# EAGLE design SevenSegmentArrays (EAGLE 6.5.0)
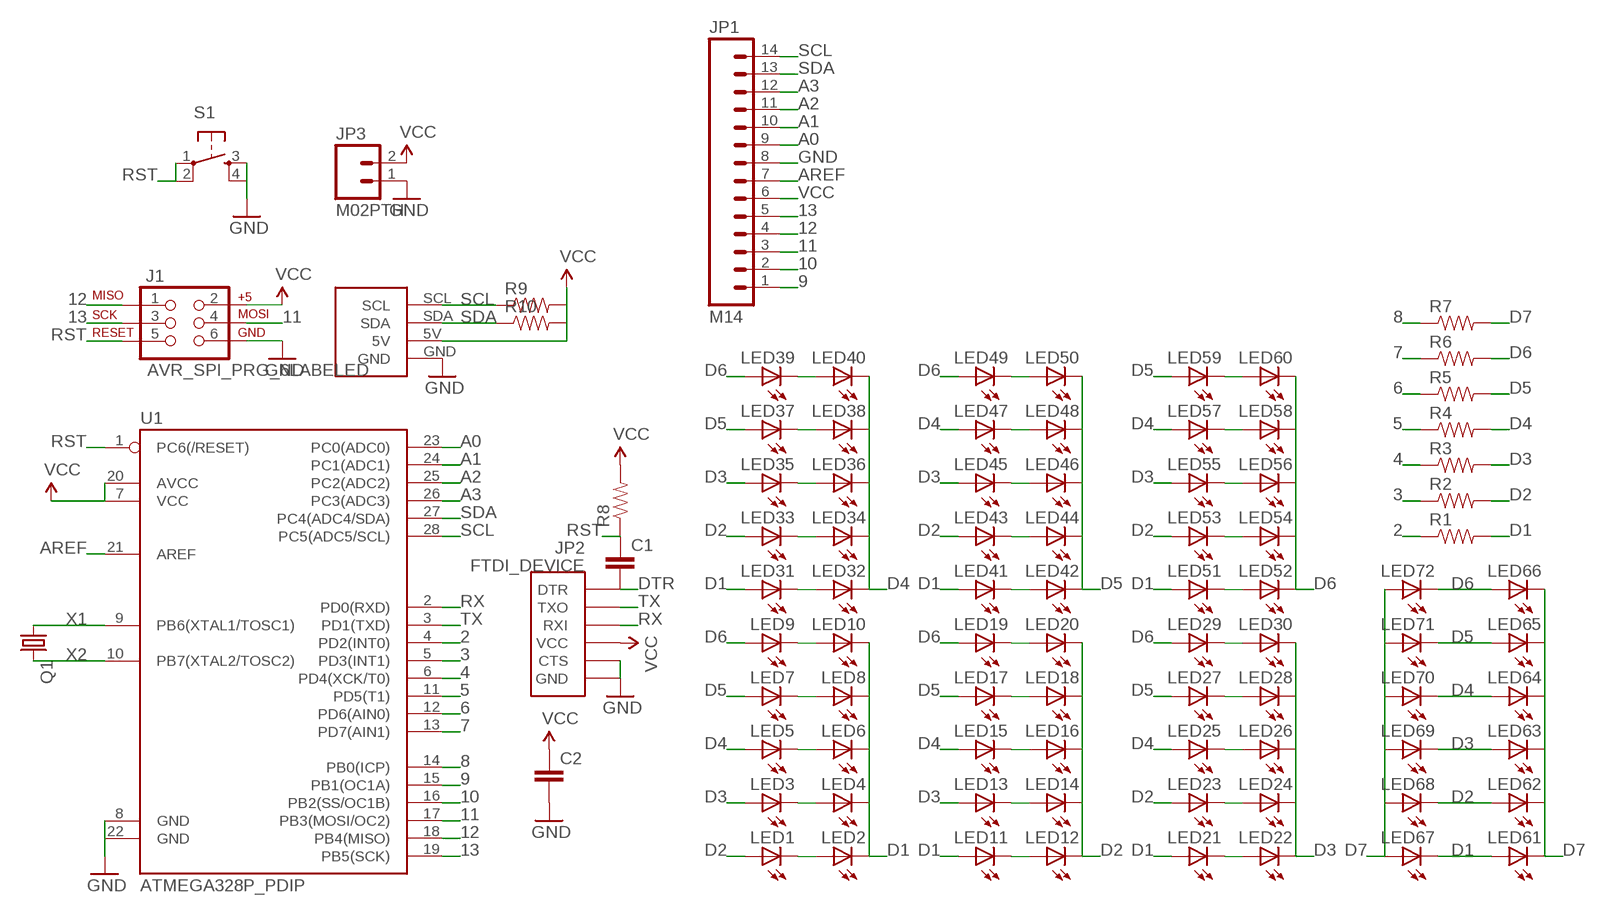
[diagram p0: schematic, sheet 1]

## Parts
C1  CAPPTH  [CAP-PTH-SMALL]
C2  CAPPTH  [CAP-PTH-SMALL]
J1  AVR_SPI_PRG_6LABELED  [2X3-NS]
JP1  M14  [1X14]
JP2  FTDI_DEVICE  [FTDI_DEVICE_SIDE]
JP3  M02PTH  [1X02]
LED1  LEDRECT  [RECTANGLE_LED]
LED2  LEDRECT  [RECTANGLE_LED]
LED3  LEDRECT  [RECTANGLE_LED]
LED4  LEDRECT  [RECTANGLE_LED]
LED5  LEDRECT  [RECTANGLE_LED]
LED6  LEDRECT  [RECTANGLE_LED]
LED7  LEDRECT  [RECTANGLE_LED]
LED8  LEDRECT  [RECTANGLE_LED]
LED9  LEDRECT  [RECTANGLE_LED]
LED10  LEDRECT  [RECTANGLE_LED]
LED11  LEDRECT  [RECTANGLE_LED]
LED12  LEDRECT  [RECTANGLE_LED]
LED13  LEDRECT  [RECTANGLE_LED]
LED14  LEDRECT  [RECTANGLE_LED]
LED15  LEDRECT  [RECTANGLE_LED]
LED16  LEDRECT  [RECTANGLE_LED]
LED17  LEDRECT  [RECTANGLE_LED]
LED18  LEDRECT  [RECTANGLE_LED]
LED19  LEDRECT  [RECTANGLE_LED]
LED20  LEDRECT  [RECTANGLE_LED]
LED21  LEDRECT  [RECTANGLE_LED]
LED22  LEDRECT  [RECTANGLE_LED]
LED23  LEDRECT  [RECTANGLE_LED]
LED24  LEDRECT  [RECTANGLE_LED]
LED25  LEDRECT  [RECTANGLE_LED]
LED26  LEDRECT  [RECTANGLE_LED]
LED27  LEDRECT  [RECTANGLE_LED]
LED28  LEDRECT  [RECTANGLE_LED]
LED29  LEDRECT  [RECTANGLE_LED]
LED30  LEDRECT  [RECTANGLE_LED]
LED31  LEDRECT  [RECTANGLE_LED]
LED32  LEDRECT  [RECTANGLE_LED]
LED33  LEDRECT  [RECTANGLE_LED]
LED34  LEDRECT  [RECTANGLE_LED]
LED35  LEDRECT  [RECTANGLE_LED]
LED36  LEDRECT  [RECTANGLE_LED]
LED37  LEDRECT  [RECTANGLE_LED]
LED38  LEDRECT  [RECTANGLE_LED]
LED39  LEDRECT  [RECTANGLE_LED]
LED40  LEDRECT  [RECTANGLE_LED]
LED41  LEDRECT  [RECTANGLE_LED]
LED42  LEDRECT  [RECTANGLE_LED]
LED43  LEDRECT  [RECTANGLE_LED]
LED44  LEDRECT  [RECTANGLE_LED]
LED45  LEDRECT  [RECTANGLE_LED]
LED46  LEDRECT  [RECTANGLE_LED]
LED47  LEDRECT  [RECTANGLE_LED]
LED48  LEDRECT  [RECTANGLE_LED]
LED49  LEDRECT  [RECTANGLE_LED]
LED50  LEDRECT  [RECTANGLE_LED]
LED51  LEDRECT  [RECTANGLE_LED]
LED52  LEDRECT  [RECTANGLE_LED]
LED53  LEDRECT  [RECTANGLE_LED]
LED54  LEDRECT  [RECTANGLE_LED]
LED55  LEDRECT  [RECTANGLE_LED]
LED56  LEDRECT  [RECTANGLE_LED]
LED57  LED3MM  [LED3MM]
LED58  LED3MM  [LED3MM]
LED59  LED3MM  [LED3MM]
LED60  LED3MM  [LED3MM]
LED61  LED3MM  [LED3MM]
LED62  LED3MM  [LED3MM]
LED63  LED3MM  [LED3MM]
LED64  LED3MM  [LED3MM]
LED65  LED3MM  [LED3MM]
LED66  LED3MM  [LED3MM]
LED67  LED3MM  [LED3MM]
LED68  LED3MM  [LED3MM]
LED69  LED3MM  [LED3MM]
LED70  LED3MM  [LED3MM]
LED71  LED3MM  [LED3MM]
LED72  LED3MM  [LED3MM]
Q1  CRYSTALTC38H  [TC38H]
R1  RESISTORAXIAL-0.3  [AXIAL-0.3]
R2  RESISTORAXIAL-0.3  [AXIAL-0.3]
R3  RESISTORAXIAL-0.3  [AXIAL-0.3]
R4  RESISTORAXIAL-0.3  [AXIAL-0.3]
R5  RESISTORAXIAL-0.3  [AXIAL-0.3]
R6  RESISTORAXIAL-0.3  [AXIAL-0.3]
R7  RESISTORAXIAL-0.3  [AXIAL-0.3]
R8  RESISTORAXIAL-0.3  [AXIAL-0.3]
R9  RESISTORAXIAL-0.3  [AXIAL-0.3]
R10  RESISTORAXIAL-0.3  [AXIAL-0.3]
S1  TAC_SWITCHPTH  [TACTILE-PTH]
U1  ATMEGA328P_PDIP  [DIL28-3]
U$1  I2C  [I2C]

## Nets
2: R1.P$1 U1.4(PD2(INT0))
3: R2.P$1 U1.5(PD3(INT1))
4: R3.P$1 U1.6(PD4(XCK/T0))
5: R4.P$1 U1.11(PD5(T1))
6: R5.P$1 U1.12(PD6(AIN0))
7: R6.P$1 U1.13(PD7(AIN1))
8: R7.P$1 U1.14(PB0(ICP))
9: JP1.1 U1.15(PB1(OC1A))
10: JP1.2 U1.16(PB2(SS/OC1B))
11: J1.4 JP1.3 U1.17(PB3(MOSI/OC2))
12: J1.1 JP1.4 U1.18(PB4(MISO))
13: J1.3 JP1.5 U1.19(PB5(SCK))
A0: JP1.9 U1.23(PC0(ADC0))
A1: JP1.10 U1.24(PC1(ADC1))
A2: JP1.11 U1.25(PC2(ADC2))
A3: JP1.12 U1.26(PC3(ADC3))
AREF: JP1.7 U1.21(AREF)
D1: LED2.C LED4.C LED6.C LED8.C LED10.C LED11.A LED21.A LED31.A LED41.A LED51.A LED61.A LED67.K(C) R1.P$2
D2: LED1.A LED12.C LED14.C LED16.C LED18.C LED20.C LED23.A LED33.A LED43.A LED53.A LED62.A LED68.K(C) R2.P$2
D3: LED3.A LED13.A LED22.C LED24.C LED26.C LED28.C LED30.C LED35.A LED45.A LED55.A LED63.A LED69.K(C) R3.P$2
D4: LED5.A LED15.A LED25.A LED32.C LED34.C LED36.C LED38.C LED40.C LED47.A LED57.A LED64.A LED70.K(C) R4.P$2
D5: LED7.A LED17.A LED27.A LED37.A LED42.C LED44.C LED46.C LED48.C LED50.C LED59.A LED65.A LED71.K(C) R5.P$2
D6: LED9.A LED19.A LED29.A LED39.A LED49.A LED52.C LED54.C LED56.C LED58.K(C) LED60.K(C) LED66.A LED72.K(C) R6.P$2
D7: LED61.K(C) LED62.K(C) LED63.K(C) LED64.K(C) LED65.K(C) LED66.K(C) LED67.A LED68.A LED69.A LED70.A LED71.A LED72.A R7.P$2
DTR: C1.2 JP2.P$1(DTR)
GND: C2.2 J1.6 JP1.8 JP2.P$5(CTS) JP2.P$6(GND) JP3.1 S1.3 S1.4 U1.8(GND) U1.22(GND) U$1.GND
N$1: LED1.C LED2.A
N$2: LED3.C LED4.A
N$3: LED5.C LED6.A
N$4: LED7.C LED8.A
N$5: LED9.C LED10.A
N$6: LED11.C LED12.A
N$7: LED13.C LED14.A
N$8: LED15.C LED16.A
N$9: LED17.C LED18.A
N$10: LED19.C LED20.A
N$11: LED21.C LED22.A
N$12: LED23.C LED24.A
N$13: LED25.C LED26.A
N$14: LED27.C LED28.A
N$15: LED29.C LED30.A
N$16: LED31.C LED32.A
N$17: LED33.C LED34.A
N$18: LED35.C LED36.A
N$19: LED37.C LED38.A
N$20: LED39.C LED40.A
N$21: LED41.C LED42.A
N$22: LED43.C LED44.A
N$23: LED45.C LED46.A
N$24: LED47.C LED48.A
N$25: LED49.C LED50.A
N$26: LED51.C LED52.A
N$27: LED53.C LED54.A
N$28: LED55.C LED56.A
N$29: LED57.K(C) LED58.A
N$30: LED59.K(C) LED60.A
RST: C1.1 J1.5 R8.P$1 S1.1 S1.2 U1.1(PC6(/RESET))
RX: JP2.P$3(RXI) U1.2(PD0(RXD))
SCL: JP1.14 R9.P$1 U1.28(PC5(ADC5/SCL)) U$1.SCL
SDA: JP1.13 R10.P$1 U1.27(PC4(ADC4/SDA)) U$1.SDA
TX: JP2.P$2(TXO) U1.3(PD1(TXD))
VCC: C2.1 J1.2 JP1.6 JP2.P$4(VCC) JP3.2 R8.P$2 R9.P$2 R10.P$2 U1.7(VCC) U1.20(AVCC) U$1.5V
X1: Q1.1 U1.9(PB6(XTAL1/TOSC1))
X2: Q1.2 U1.10(PB7(XTAL2/TOSC2))

## Library data of the parts
C1 C2 = SparkFun-Capacitors:CAP: Capacitor Standard 0603 ceramic capacitor, and 0.1" leaded capacitor.
J1 = barbary_enterprises:AVR_SPI_PRG_6: AVR ISP 6 Pin This is the reduced ISP connector for AVR programming. Common on Arduino. This footprint will take up less PCB space and can be used with a 10-pin to 6-pin adapter such as SKU: BOB-08508
JP1 = SparkFun-Connectors:M14: Header 14 Standard 14-pin 0.1" header. Use with straight break away headers (SKU : PRT-00116), right angle break away headers (PRT-00553), swiss pins (PRT-00743), machine pins (PRT-00117), and female headers (PRT-00115).
JP2 = SparkFun-Connectors:FTDI_DEVICE: Connector which mates to FTDI basic or FTDI cable.
JP3 = SparkFun-Connectors:M02: Standard 2-pin 0.1" header. Use with - straight break away headers ( PRT-00116) - right angle break away headers (PRT-00553) - swiss pins (PRT-00743) - machine pins (PRT-00117) - female headers (PRT-00115) Molex polarized connector foot print use with: PRT-08233 with associated crimp pins and housings. 2.54_SCREWTERM for use with PRT-10571. 3.5mm Screw Terminal footprints for PRT-08084 5mm Screw Terminal footprints for use with PRT-08433
LED1-LED72 = barbary_enterprises:LED: LEDs Standard schematic elements and footprints for 5mm, 3mm, 1206, and 0603 sized LEDs. 5mm - Spark Fun Electronics SKU : COM-00529 (and others)
Q1 = adafruit:CRYSTAL: CRYSTAL; OC_FARNELL: unknown; OC_NEWARK: unknown
R1-R10 = SparkFun-Resistors:RESISTOR: Resistor Basic schematic elements and footprints for 0603, 1206, and PTH resistors.
S1 = SparkFun-Electromechanical:TAC_SWITCH: Momentary Switch Button commonly used for reset or general input. Spark Fun Electronics SKU : COM-00097 SMT- SWCH-08247
U1 = SparkFun-DigitalIC:ATMEGA328P_PDIP: uC used in the Arduino 32kb flash, 1k EEPROM, 2k SRAM This is the through-hole version of this chip.
U$1 = barbary_enterprises:I2C

## Board
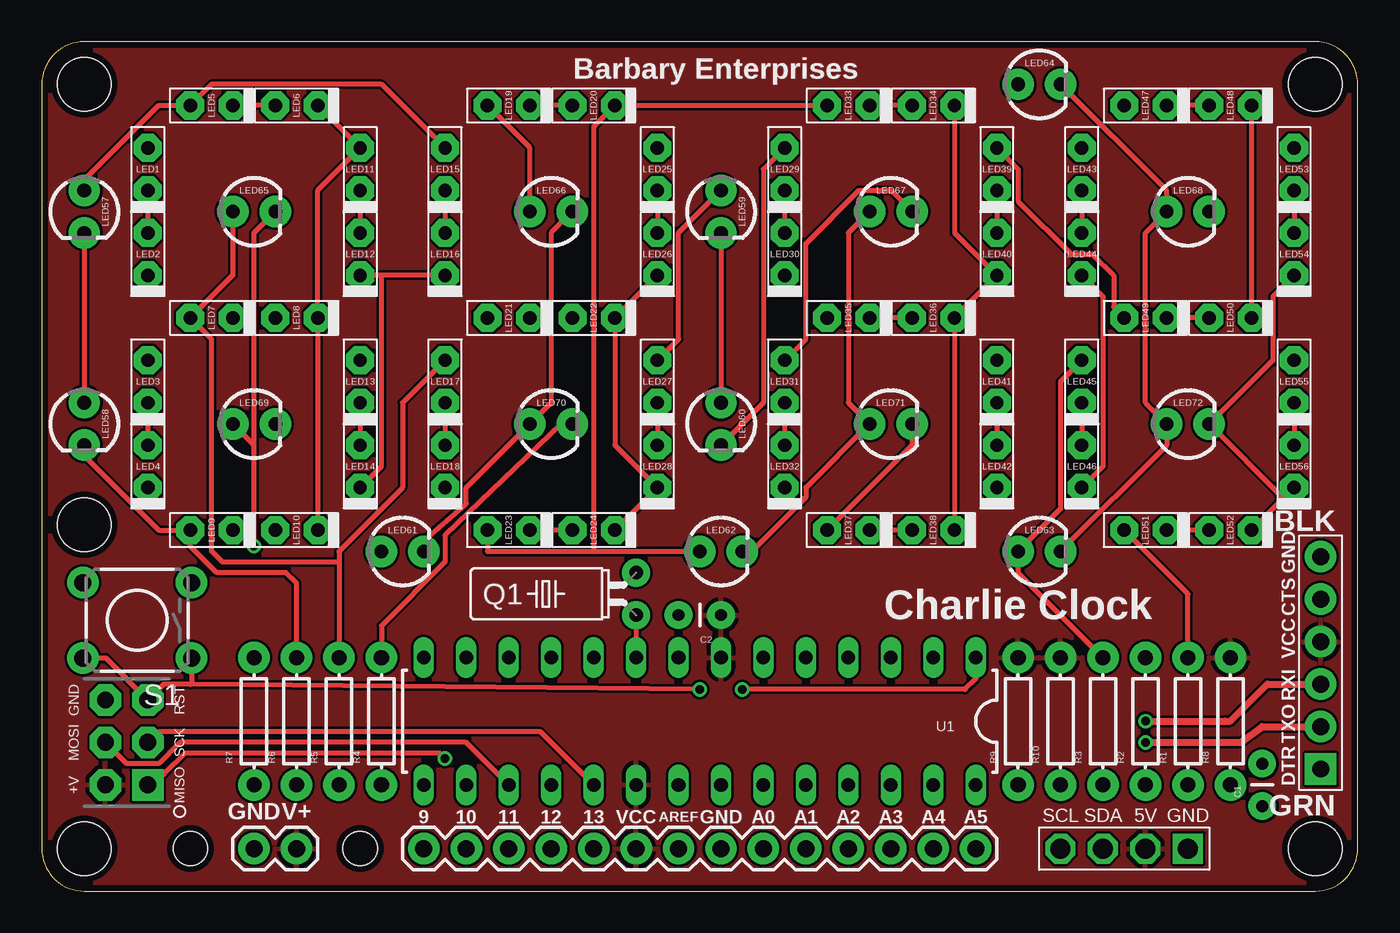
[diagram p1: board, top side]
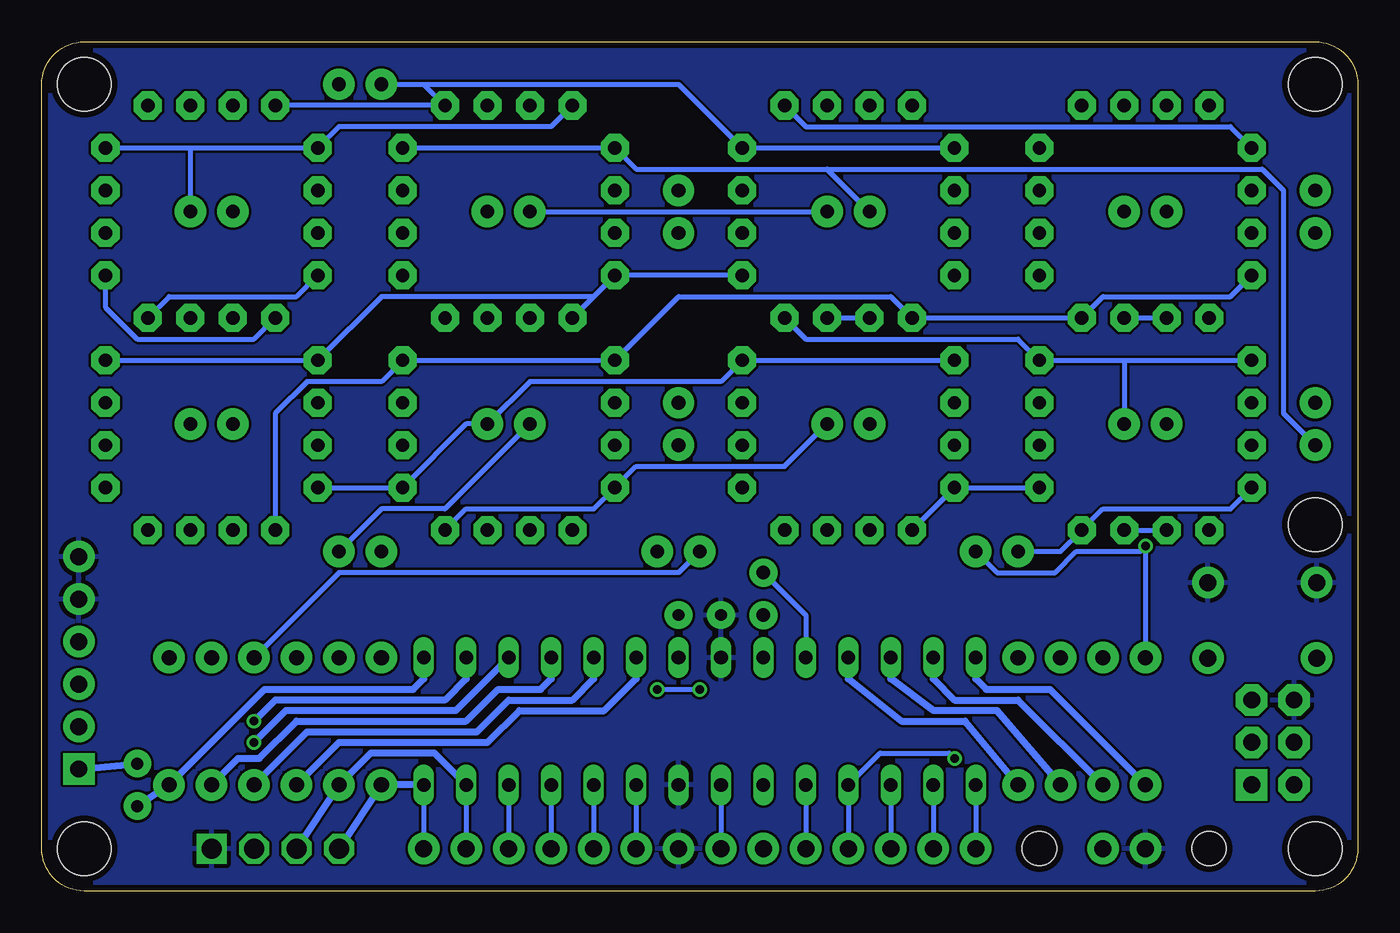
[diagram p2: board, bottom side, seen from below]

Size 78.74 x 50.8 mm. Coordinates in mm from the lower left corner, seen from the top.
Outline: 78.74,2.54 78.74,48.26 arc90 76.2,50.8 2.54,50.8 arc90 0,48.26 0,2.54 arc90 2.54,0 76.2,0 arc90 78.74,2.54
Copper layers (1*16): Top 0.0356mm / dielectric 1.5011mm / Bottom 0.0356mm
Design rules "LaenPCBOrder": minimum track width 6mil, minimum drill 13mil, track to track 6mil, track to pad 6mil, pad to pad 6mil, via to via 6mil, smd to smd 6mil, copper to edge 15mil, drill to drill 6mil, minimum pad ring 7mil, minimum via ring 7mil, stop-mask expansion 3mil, vias tented up to drill 0mil, thermal gap 10mil
Holes 3.17 mm at 76.2,48.26 2.54,48.26 2.54,2.54 2.54,21.91 76.2,2.54
Holes 2.03 mm at 8.89,2.54 19.05,2.54

### Footprints (pad centres in the part's own frame; a part is rotated, then mirrored left to right if it is on the bottom)
CAP-PTH-SMALL = drill 0.7 pad 1.651: 1 0,0; 2 2.54,0
2X3-NS = drill 1.016 pad 1.88 square: 1 -2.54,-1.27 | drill 1.016 pad 1.88 octagon: 2 -2.54,1.27; 3 0,-1.27; 4 0,1.27; 5 2.54,-1.27; 6 2.54,1.27
1X14 = drill 1.016 pad 1.88: 1 0,0; 2 2.54,0; 3 5.08,0; 4 7.62,0; 5 10.16,0; 6 12.7,0; 7 15.24,0; 8 17.78,0; 9 20.32,0; 10 22.86,0; 11 25.4,0; 12 27.94,0; 13 30.48,0; 14 33.02,0
FTDI_DEVICE_SIDE = drill 1.016 pad 1.88 square: P$1 -6.35,0 | drill 1.016 pad 1.88: P$2 -3.81,0; P$3 -1.27,0; P$4 1.27,0; P$5 3.81,0; P$6 6.35,0
1X02 = drill 1.016 pad 1.88: 1 0,0; 2 2.54,0
RECTANGLE_LED = drill 0.8 pad 1.676 octagon: A 0,1.27; C 0,-1.27
LED3MM = drill 0.813 pad 1.88: A -1.27,0; K 1.27,0
TC38H = drill 0.813 pad 1.676: 1 -1.27,0; 2 1.27,0
AXIAL-0.3 = drill 0.9 pad 1.88: P$1 -3.81,0; P$2 3.81,0
TACTILE-PTH = drill 1.016 pad 1.88: 1 -3.251,2.261; 2 3.251,2.261; 3 -3.251,-2.261; 4 3.251,-2.261
DIL28-3 = drill 0.813 long: 1 -16.51,-3.81; 2 -13.97,-3.81; 3 -11.43,-3.81; 4 -8.89,-3.81; 5 -6.35,-3.81; 6 -3.81,-3.81; 7 -1.27,-3.81; 8 1.27,-3.81; 9 3.81,-3.81; 10 6.35,-3.81; 11 8.89,-3.81; 12 11.43,-3.81; 13 13.97,-3.81; 14 16.51,-3.81; 15 16.51,3.81; 16 13.97,3.81; 17 11.43,3.81; 18 8.89,3.81; 19 6.35,3.81; 20 3.81,3.81; 21 1.27,3.81; 22 -1.27,3.81; 23 -3.81,3.81; 24 -6.35,3.81; 25 -8.89,3.81; 26 -11.43,3.81; 27 -13.97,3.81; 28 -16.51,3.81
I2C = drill 1.2 octagon: 5V 0,2.54; SCL 0,7.62; SDA 0,5.08 | drill 1.2 square: GND 0,0

### Placement (x,y rotation side)
C1  73.03,5.08 90 top
C2  40.64,16.51 180 top
J1  5.08,8.89 90 top
JP1  22.86,2.54 0 top
JP2  76.52,13.65 90 top
JP3  12.7,2.54 0 top
LED1  6.35,43.18 0 top
LED2  6.35,38.1 0 top
LED3  6.35,30.48 0 top
LED4  6.35,25.4 0 top
LED5  10.16,46.99 90 top
LED6  15.24,46.99 90 top
LED7  10.16,34.29 90 top
LED8  15.24,34.29 90 top
LED9  10.16,21.59 90 top
LED10  15.24,21.59 90 top
LED11  19.05,43.18 0 top
LED12  19.05,38.1 0 top
LED13  19.05,30.48 0 top
LED14  19.05,25.4 0 top
LED15  24.13,43.18 0 top
LED16  24.13,38.1 0 top
LED17  24.13,30.48 0 top
LED18  24.13,25.4 0 top
LED19  27.94,46.99 90 top
LED20  33.02,46.99 90 top
LED21  27.94,34.29 90 top
LED22  33.02,34.29 90 top
LED23  27.94,21.59 90 top
LED24  33.02,21.59 90 top
LED25  36.83,43.18 0 top
LED26  36.83,38.1 0 top
LED27  36.83,30.48 0 top
LED28  36.83,25.4 0 top
LED29  44.45,43.18 0 top
LED30  44.45,38.1 0 top
LED31  44.45,30.48 0 top
LED32  44.45,25.4 0 top
LED33  48.26,46.99 90 top
LED34  53.34,46.99 90 top
LED35  48.26,34.29 90 top
LED36  53.34,34.29 90 top
LED37  48.26,21.59 90 top
LED38  53.34,21.59 90 top
LED39  57.15,43.18 0 top
LED40  57.15,38.1 0 top
LED41  57.15,30.48 0 top
LED42  57.15,25.4 0 top
LED43  62.23,43.18 0 top
LED44  62.23,38.1 0 top
LED45  62.23,30.48 0 top
LED46  62.23,25.4 0 top
LED47  66.04,46.99 90 top
LED48  71.12,46.99 90 top
LED49  66.04,34.29 90 top
LED50  71.12,34.29 90 top
LED51  66.04,21.59 90 top
LED52  71.12,21.59 90 top
LED53  74.93,43.18 0 top
LED54  74.93,38.1 0 top
LED55  74.93,30.48 0 top
LED56  74.93,25.4 0 top
LED57  2.54,40.64 270 top
LED58  2.54,27.94 270 top
LED59  40.64,40.64 270 top
LED60  40.64,27.94 270 top
LED61  21.59,20.32 0 top
LED62  40.64,20.32 0 top
LED63  59.69,20.32 0 top
LED64  59.69,48.26 0 top
LED65  12.7,40.64 0 top
LED66  30.48,40.64 0 top
LED67  50.8,40.64 0 top
LED68  68.58,40.64 0 top
LED69  12.7,27.94 0 top
LED70  30.48,27.94 0 top
LED71  50.8,27.94 0 top
LED72  68.58,27.94 0 top
Q1  35.56,17.78 90 top
R1  68.58,10.16 90 top
R2  66.04,10.16 90 top
R3  63.5,10.16 90 top
R4  20.32,10.16 90 top
R5  17.78,10.16 90 top
R6  15.24,10.16 90 top
R7  12.7,10.16 90 top
R8  71.12,10.16 90 top
R9  58.42,10.16 90 top
R10  60.96,10.16 90 top
S1  5.71,16.19 180 top
U1  39.37,10.16 180 top
U$1  68.58,2.54 90 top

### Tracks (layer width: path | path; a pad name or v marks a point on that pad's centre or on a via)
2
  Bottom 0.406: R1.P$1 66.99,7.94 65.72,7.94 63.5,10.16 53.34,10.16 51.44,12.06 48.9,12.06 48.26,12.7 U1.4
3
  Bottom 0.406: R2.P$1 62.87,9.53 52.7,9.53 50.8,11.43 46.99,11.43 45.72,12.7 U1.5
4
  Bottom 0.406: R3.P$1 60.96,8.89 52.07,8.89 50.16,10.79 45.09,10.79 43.18,12.7 U1.6
5
  Bottom 0.406: U1.11 30.48,12.7 27.3,10.16 23.5,10.16 R4.P$1
6
  Bottom 0.406: R5.P$1 21.59,10.79 25.4,10.79 27.94,12.7 U1.12
7
  Bottom 0.406: U1.13 25.4,12.7 24.13,11.43 20.32,11.43 R6.P$1
8
  Bottom 0.406: U1.14 22.86,12.7 22.23,12.06 18.41,12.06 R7.P$1
9
  Bottom 0.305: U1.15 JP1.1
10
  Bottom 0.305: U1.16 JP1.2
11
  Top 0.305: U1.17 25.4,8.89 8.26,8.89 6.99,7.62 5.08,7.62 J1.4
  Bottom 0.305: U1.17 JP1.3
12  (via drill 0.51)
  Top 0.305: v24.13,7.94 23.81,8.26 8.57,8.26 7.3,6.99 6.99,6.99 J1.1
  Bottom 0.305: v24.13,7.94 24.45,8.26 28.57,8.26 U1.18 JP1.4
13
  Top 0.305: U1.19 29.84,9.53 6.99,9.53 J1.3
  Bottom 0.305: U1.19 JP1.5
A0
  Bottom 0.305: U1.23 JP1.9
A1
  Bottom 0.305: U1.24 JP1.10
A2
  Bottom 0.305: U1.25 JP1.11
A3
  Bottom 0.305: U1.26 JP1.12
AREF
  Bottom 0.305: U1.21 JP1.7
D1
  Top 0.305: LED6.C LED11.A 16.51,41.91 LED8.C LED10.C | LED51.A 68.58,17.78 R1.P$2 | LED67.K 50.8,41.91 48.9,41.91 45.72,38.73 45.72,33.02 LED31.A
  Bottom 0.305: LED61.A 17.78,20.32 LED10.C 15.24,22.86 7.62,22.86 LED4.C | LED2.C 7.62,35.56 15.24,35.56 LED8.C LED21.A 27.94,35.56 40.64,35.56 LED31.A LED41.A 58.42,30.48 62.87,30.48 64.77,28.57 LED51.A
D2
  Top 0.305: LED16.C 20.32,36.83 | 20.32,36.83 LED12.C | 33.02,20.32 26.67,20.32 LED23.A | 33.02,20.32 LED62.A | 20.32,36.83 20.32,25.4 LED14.C | LED33.A LED20.C 33.02,45.72 33.02,20.32
  Bottom 0.305: LED14.C LED18.C LED23.A | R2.P$2 60.96,19.05 40.64,19.05 LED62.A | LED53.A 69.85,44.45 | 69.85,44.45 LED43.A 60.96,45.72 48.26,45.72 LED33.A | 69.85,44.45 LED68.K | LED1.A 7.62,45.72 33.02,45.72 LED20.C
D3
  Top 0.305: R3.P$2 58.42,19.05 LED63.A 60.96,22.86 60.96,30.48 LED45.A | LED24.C LED28.C 34.29,26.67 LED22.C LED26.C
  Bottom 0.305: LED55.A LED45.A 58.42,35.56 45.72,35.56 | 13.97,31.75 LED13.A 20.32,33.02 33.02,33.02 LED22.C | 13.97,31.75 LED3.A | 13.97,31.75 LED69.K | 45.72,35.56 LED30.C LED26.C | 45.72,35.56 LED35.A
D4
  Top 0.305: LED57.A 2.54,42.55 6.99,46.99 LED5.A 10.16,48.26 20.32,48.26 LED15.A | R4.P$2 20.32,15.88 24.13,19.68 24.13,21.27 31.11,27.94 LED70.K | LED34.C 54.61,39.37 LED40.C LED36.C LED38.C
  Bottom 0.305: LED15.A LED25.A 40.64,48.26 55.88,48.26 | LED38.C 53.34,22.86 45.72,22.86 LED32.C 43.18,25.4 34.29,25.4 LED70.K | 55.88,48.26 LED34.C LED47.A | LED64.A 55.88,48.26
D5
  Top 0.305: LED37.A 52.07,26.67 LED71.K | LED50.C LED48.C | LED46.C 63.5,25.4 63.5,35.56 LED44.C | LED65.A 11.43,36.83 LED7.A 10.16,33.02 10.16,20.32 10.79,19.68 17.78,19.68 | 17.78,19.68 17.78,20.32 21.59,24.13 21.59,29.21 LED17.A | 17.78,19.68 R5.P$2 | LED59.A 38.1,39.37 38.1,33.02 LED27.A
  Bottom 0.305: LED46.C LED42.C 53.34,27.94 LED71.K 49.53,30.48 38.1,30.48 LED27.A LED17.A | LED44.C 63.5,35.56 71.12,35.56 LED50.C
D6
  Top 0.305: LED58.K 2.54,26.04 6.99,21.59 LED9.A 8.89,20.64 10.48,19.05 14.61,19.05 15.24,18.41 R6.P$2 | LED56.C 74.3,23.5 | 74.3,23.5 LED52.C | 74.3,23.5 LED72.K 73.66,31.75 73.66,35.56 LED54.C | LED19.A 29.21,44.45 LED66.A | LED60.K 43.18,29.21 43.18,43.18 LED29.A | LED49.A 64.14,34.92 64.14,36.83 62.87,38.1 61.59,38.1 58.42,41.27 58.42,43.18 LED39.A
  Bottom 0.305: LED49.A 66.04,33.02 73.03,33.02 74.93,34.92 LED54.C | LED39.A LED29.A 43.18,43.18 31.75,43.18 | 31.75,43.18 LED66.A | LED58.K 4.45,28.57 4.45,41.91 5.71,43.18 31.75,43.18
D7  (via drill 0.51)
  Top 0.305: 12.7,26.67 LED69.A | v12.7,20.64 12.7,26.67 | LED65.K 12.7,39.37 12.7,26.67 | LED61.K 22.86,20.95 25.4,23.18 25.4,24.13 LED70.A 30.48,29.21 30.48,39.37 LED66.K | LED63.K 67.31,26.67 LED72.A 66.04,29.21 66.04,39.37 LED68.A 67.31,41.91 LED64.K | LED62.K 42.48,20.32 45.72,23.56 45.72,24.13 LED71.A 48.26,29.21 48.26,39.37 LED67.A
  Bottom 0.305: R7.P$2 v12.7,20.64 13.02,20.32 16.83,20.32 18.1,19.05 21.59,19.05 LED61.K | LED67.A LED66.K | LED63.K 58.42,22.86 54.61,22.86 LED71.A
DTR
  Bottom 0.406: JP2.P$1 C1.2
GND
  pour Bottom: 0,50.8 0,2.54 arc90 2.54,0 76.2,0 arc90 78.74,2.54 78.74,50.8
N$1
  Top 0.305: LED1.C LED2.A
N$2
  Top 0.305: LED3.C LED4.A
N$3
  Top 0.305: LED6.A LED5.C
N$4
  Bottom 0.305: LED8.A LED7.C
N$5
  Bottom 0.305: LED10.A LED9.C
N$6
  Top 0.305: LED11.C LED12.A
N$7
  Top 0.305: LED13.C LED14.A
N$8
  Top 0.305: LED15.C LED16.A
N$9
  Top 0.305: LED17.C LED18.A
N$10
  Top 0.305: LED20.A LED19.C
N$11
  Bottom 0.305: LED22.A LED21.C
N$12
  Top 0.305: LED24.A LED23.C
N$13
  Top 0.305: LED25.C LED26.A
N$14
  Top 0.305: LED27.C LED28.A
N$15
  Top 0.305: LED29.C LED30.A
N$16
  Top 0.305: LED31.C LED32.A
N$17
  Top 0.305: LED34.A LED33.C
N$18
  Top 0.305: LED36.A LED35.C
N$19
  Top 0.305: LED38.A LED37.C
N$20
  Top 0.305: LED39.C LED40.A
N$21
  Top 0.305: LED41.C LED42.A
N$22
  Top 0.305: LED43.C LED44.A
N$23
  Top 0.305: LED45.C LED46.A
N$24
  Top 0.305: LED48.A LED47.C
N$25
  Top 0.305: LED50.A LED49.C
N$26
  Top 0.305: LED52.A LED51.C
N$27
  Top 0.305: LED53.C LED54.A
N$28
  Top 0.305: LED55.C LED56.A
N$29
  Top 0.305: LED57.K LED58.A
N$30
  Top 0.305: LED59.K LED60.A
RST  (via drill 0.51)
  Top 0.305: U1.1 55.88,12.7 55.24,12.06 v41.91,12.06 | v39.37,12.06 8.89,12.37 | 8.89,12.37 7.3,12.38 J1.5 3.85,13.93 S1.2 | S1.1 8.97,12.44 8.89,12.37
  Bottom 0.305: v41.91,12.06 v39.37,12.06
  Bottom 0.406: U1.1 55.88,12.7 56.52,12.06 65.41,12.06 R8.P$1 C1.1
RX  (via drill 0.51)
  Top 0.406: v66.04,10.16 70.8,10.16 71.12,10.16 73.34,12.38 JP2.P$3
  Bottom 0.406: U1.2 53.34,12.7 54.61,11.43 64.77,11.43 v66.04,10.16
SCL
  Bottom 0.305: U1.28 JP1.14
  Bottom 0.406: U1.28 R9.P$1 U$1.SCL
SDA
  Bottom 0.305: U1.27 JP1.13
  Bottom 0.406: U1.27 55.24,8.26 59.05,8.26 R10.P$1 U$1.SDA
TX  (via drill 0.51)
  Top 0.406: v66.04,8.89 71.75,8.89 73.03,9.84 JP2.P$2
  Bottom 0.406: U1.3 53.98,10.79 64.14,10.79 v66.04,8.89
VCC
  pour Top: 0,50.8 0,2.54 arc90 2.54,0 76.2,0 arc90 78.74,2.54 78.74,50.8
X1
  Top 0.305: Q1.1 U1.9
X2
  Bottom 0.305: Q1.2 33.02,16.51 U1.10

### Text on the board
tPlace: Barbary Enterprises | Charlie Clock | GND | V+ | 9 | 10 | 11 | 12 | 13 | VCC | AREF | GND | A0 | A1 | A2 | A3 | A4 | A5